# EAGLE schematic ARM_board (EAGLE 6.5.0)
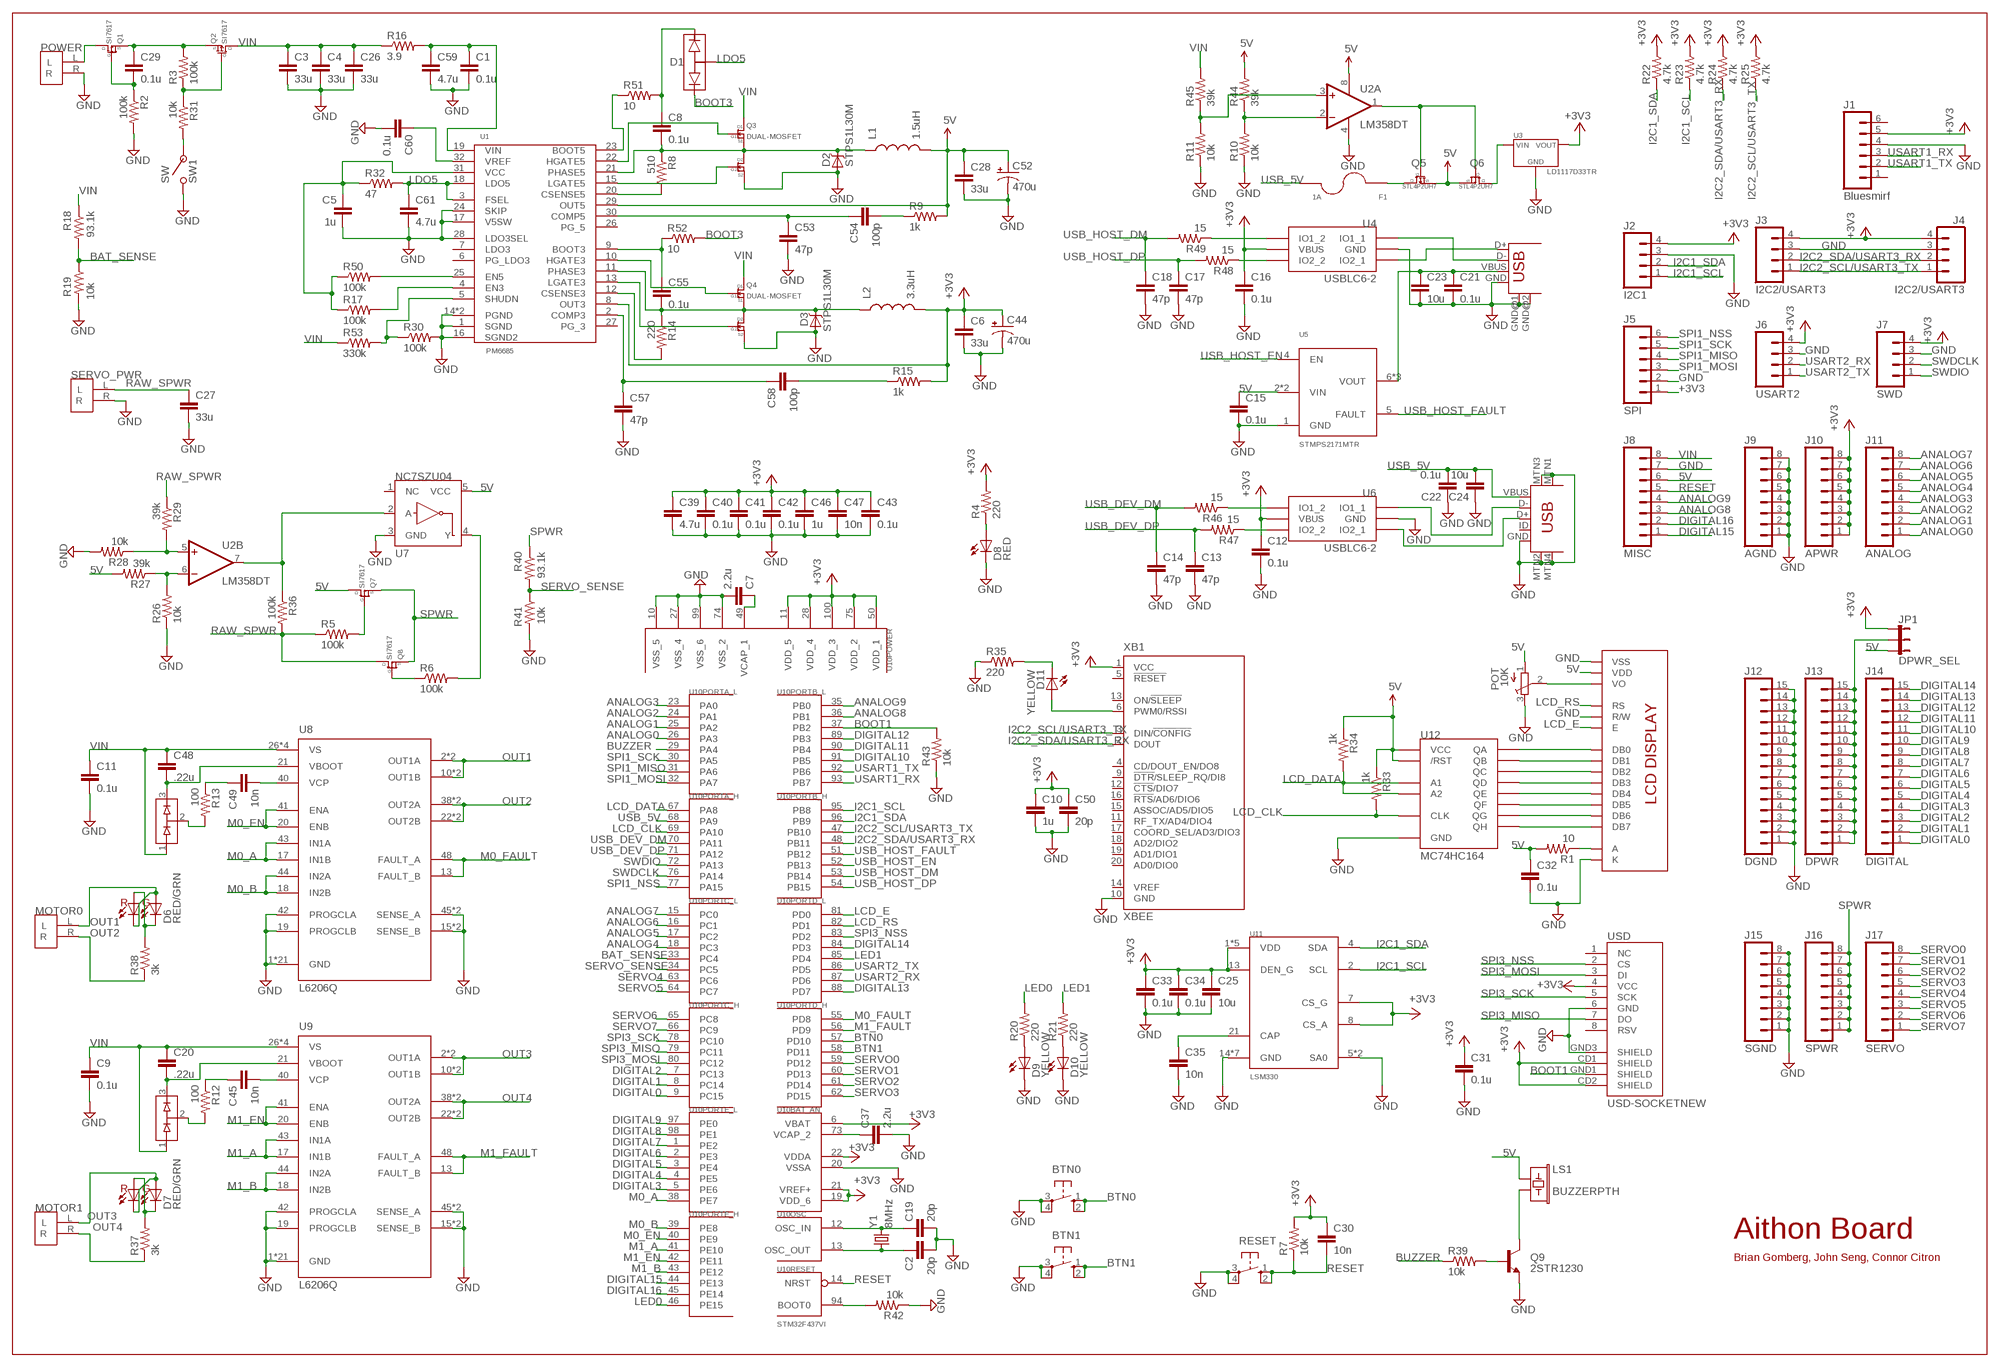
[diagram p0: schematic, sheet 1]

## Parts
BTN0  10-XX  [B3F-10XX]
BTN1  10-XX  [B3F-10XX]
C1  0.1u  CAP0402-CAP  [0402-CAP]
C2  20p  CAP0402-CAP  [0402-CAP]
C3  33u  CAP1206  [1206]
C4  33u  CAP1206  [1206]
C5  1u  CAP0402-CAP  [0402-CAP]
C6  33u  CAP0805  [0805]
C7  2.2u  CAP0402-CAP  [0402-CAP]
C8  0.1u  CAP0402-CAP  [0402-CAP]
C9  0.1u  CAP0402-CAP  [0402-CAP]
C10  1u  CAP0402-CAP  [0402-CAP]
C11  0.1u  CAP0402-CAP  [0402-CAP]
C12  0.1u  CAP0402-CAP  [0402-CAP]
C13  47p  CAP0402-CAP  [0402-CAP]
C14  47p  CAP0402-CAP  [0402-CAP]
C15  0.1u  CAP0402-CAP  [0402-CAP]
C16  0.1u  CAP0402-CAP  [0402-CAP]
C17  47p  CAP0402-CAP  [0402-CAP]
C18  47p  CAP0402-CAP  [0402-CAP]
C19  20p  CAP0402-CAP  [0402-CAP]
C20  .22u  CAP0402-CAP  [0402-CAP]
C21  0.1u  CAP0402-CAP  [0402-CAP]
C22  0.1u  CAP0402-CAP  [0402-CAP]
C23  10u  CAP0603-CAP  [0603-CAP]
C24  10u  CAP0603-CAP  [0603-CAP]
C25  10u  CAP0603-CAP  [0603-CAP]
C26  33u  CAP1206  [1206]
C27  33u  CAP1206  [1206]
C28  33u  CAP0805  [0805]
C29  0.1u  CAP0402-CAP  [0402-CAP]
C30  10n  CAP0402-CAP  [0402-CAP]
C31  0.1u  CAP0402-CAP  [0402-CAP]
C32  0.1u  CAP0402-CAP  [0402-CAP]
C33  0.1u  CAP0402-CAP  [0402-CAP]
C34  0.1u  CAP0402-CAP  [0402-CAP]
C35  10n  CAP0402-CAP  [0402-CAP]
C37  2.2u  CAP0402-CAP  [0402-CAP]
C39  4.7u  CAP0603-CAP  [0603-CAP]
C40  0.1u  CAP0402-CAP  [0402-CAP]
C41  0.1u  CAP0402-CAP  [0402-CAP]
C42  0.1u  CAP0402-CAP  [0402-CAP]
C43  0.1u  CAP0402-CAP  [0402-CAP]
C44  470u  CAP_POLD  [PANASONIC_D]
C45  10n  CAP0402-CAP  [0402-CAP]
C46  1u  CAP0402-CAP  [0402-CAP]
C47  10n  CAP0402-CAP  [0402-CAP]
C48  .22u  CAP0402-CAP  [0402-CAP]
C49  10n  CAP0402-CAP  [0402-CAP]
C50  20p  CAP0402-CAP  [0402-CAP]
C52  470u  CAP_POLD  [PANASONIC_D]
C53  47p  CAP0402-CAP  [0402-CAP]
C54  100p  CAP0402-CAP  [0402-CAP]
C55  0.1u  CAP0402-CAP  [0402-CAP]
C57  47p  CAP0402-CAP  [0402-CAP]
C58  100p  CAP0402-CAP  [0402-CAP]
C59  4.7u  CAP0603-CAP  [0603-CAP]
C60  0.1u  CAP0402-CAP  [0402-CAP]
C61  4.7u  CAP0603-CAP  [0603-CAP]
D1  BAS70-06FILM  SOD-23  [SOT-23]
D2  STPS1L30M  DIODE-SCHOTTKYA  [STPS1L30M]
D3  STPS1L30M  DIODE-SCHOTTKYA  [STPS1L30M]
D4  BAS70-05FILM  BAV99  [SOT-23]
D5  BAV99  [SOT-23]
D6  RED/GRN  LED_BICOLOR  [LED-0606]
D7  RED/GRN  LED_BICOLOR  [LED-0606]
D8  RED  LEDCHIP-LED0603  [CHIP-LED0603]
D9  YELLOW  LEDCHIP-LED0603  [CHIP-LED0603]
D10  YELLOW  LEDCHIP-LED0603  [CHIP-LED0603]
D11  YELLOW  LEDCHIP-LED0603  [CHIP-LED0603]
F1  1A  POLYFUSE  [1206]
J1  Bluesmirf  M06SIP  [1X06]
J2  I2C1  M04PTH  [1X04]
J3  I2C2/USART3  M04PTH  [1X04]
J4  I2C2/USART3  M04PTH  [1X04]
J5  SPI  M06SIP  [1X06]
J6  USART2  M04PTH  [1X04]
J7  SWD  M04PTH  [1X04]
J8  MISC  M081X08  [1X08]
J9  AGND  M081X08  [1X08]
J10  APWR  M081X08  [1X08]
J11  ANALOG  M081X08  [1X08]
J12  DGND  M15  [1X15]
J13  DPWR  M15  [1X15]
J14  DIGITAL  M15  [1X15]
J15  SGND  M081X08  [1X08]
J16  SPWR  M081X08  [1X08]
J17  SERVO  M081X08  [1X08]
JP1  DPWR_SEL  JUMPER-3PTH  [1X03]
L1  1.5uH  INDUCTOR2  [INDUCTOR-LMIP707]
L2  3.3uH  INDUCTOR3  [INDUCTOR-0520CDMCDS]
LCD  LCD_DISPLAY  [LCD]
LS1  BUZZERPTH  [BUZZER-12MM]
MOTOR0  2POS_TERMINAL  [2POS_TERMINAL]
MOTOR1  2POS_TERMINAL  [2POS_TERMINAL]
POT  10K  POT  [POT]
POWER  2POS_TERMINAL  [2POS_TERMINAL]
Q1  SI7617  [POWERPAK1212-8]
Q2  SI7617  [POWERPAK1212-8]
Q3  DUAL-MOSFET  [DUAL-MOSFET-STL60N32N3LL]
Q4  DUAL-MOSFET  [DUAL-MOSFET-STL60N32N3LL]
Q5  STL4P2UH7  [POWERFLAT]
Q6  STL4P2UH7  [POWERFLAT]
Q7  SI7617  [POWERPAK1212-8]
Q8  SI7617  [POWERPAK1212-8]
Q9  2STR1230  TRANSISTOR_NPNSOT23-3  [SOT23-3]
R1  10  RESISTOR0402-RES  [0402-RES]
R2  100k  RESISTOR0402-RES  [0402-RES]
R3  100k  RESISTOR0402-RES  [0402-RES]
R4  220  RESISTOR0402-RES  [0402-RES]
R5  100k  RESISTOR0402-RES  [0402-RES]
R6  100k  RESISTOR0402-RES  [0402-RES]
R7  10k  RESISTOR0402-RES  [0402-RES]
R8  510  RESISTOR0402-RES  [0402-RES]
R9  1k  RESISTOR0402-RES  [0402-RES]
R10  10k  RESISTOR0402-RES  [0402-RES]
R11  10k  RESISTOR0402-RES  [0402-RES]
R12  100  RESISTOR0402-RES  [0402-RES]
R13  100  RESISTOR0402-RES  [0402-RES]
R14  220  RESISTOR0402-RES  [0402-RES]
R15  1k  RESISTOR0402-RES  [0402-RES]
R16  3.9  RESISTOR0402-RES  [0402-RES]
R17  100k  RESISTOR0402-RES  [0402-RES]
R18  93.1k  RESISTOR0402-RES  [0402-RES]
R19  10k  RESISTOR0402-RES  [0402-RES]
R20  220  RESISTOR0402-RES  [0402-RES]
R21  220  RESISTOR0402-RES  [0402-RES]
R22  4.7k  RESISTOR0402-RES  [0402-RES]
R23  4.7k  RESISTOR0402-RES  [0402-RES]
R24  4.7k  RESISTOR0402-RES  [0402-RES]
R25  4.7k  RESISTOR0402-RES  [0402-RES]
R26  10k  RESISTOR0402-RES  [0402-RES]
R27  39k  RESISTOR0402-RES  [0402-RES]
R28  10k  RESISTOR0402-RES  [0402-RES]
R29  39k  RESISTOR0402-RES  [0402-RES]
R30  100k  RESISTOR0402-RES  [0402-RES]
R31  10k  RESISTOR0402-RES  [0402-RES]
R32  47  RESISTOR0402-RES  [0402-RES]
R33  1k  RESISTOR0402-RES  [0402-RES]
R34  1k  RESISTOR0402-RES  [0402-RES]
R35  220  RESISTOR0402-RES  [0402-RES]
R36  100k  RESISTOR0402-RES  [0402-RES]
R37  3k  RESISTOR0603-RES  [0603-RES]
R38  3k  RESISTOR0603-RES  [0603-RES]
R39  10k  RESISTOR0402-RES  [0402-RES]
R40  93.1k  RESISTOR0402-RES  [0402-RES]
R41  10k  RESISTOR0402-RES  [0402-RES]
R42  10k  RESISTOR0402-RES  [0402-RES]
R43  10k  RESISTOR0402-RES  [0402-RES]
R44  39k  RESISTOR0402-RES  [0402-RES]
R45  39k  RESISTOR0402-RES  [0402-RES]
R46  15  RESISTOR0402-RES  [0402-RES]
R47  15  RESISTOR0402-RES  [0402-RES]
R48  15  RESISTOR0402-RES  [0402-RES]
R49  15  RESISTOR0402-RES  [0402-RES]
R50  100k  RESISTOR0402-RES  [0402-RES]
R51  10  RESISTOR0402-RES  [0402-RES]
R52  10  RESISTOR0402-RES  [0402-RES]
R53  330k  RESISTOR0402-RES  [0402-RES]
RESET  10-XX  [B3F-10XX]
SERVO_PWR  2POS_TERMINAL  [2POS_TERMINAL]
SW1  SW  [SW]
U1  PM6685  [VFQFPN-32]
U2  LM358DT  LM358D  [SO08]
U3  LD1117D33TR  LD1117  [8-SOIC]
U4  USBLC6-2  [SOT23-6L]
U5  STMPS2171MTR  RT9715  [8-SOIC]
U6  USBLC6-2  [SOT23-6L]
U7  NC7SZU04  INVERTER""  [SC70]
U8  L6206Q  [VFQFPN48]
U9  L6206Q  [VFQFPN48]
U10  STM32F437VI  STM32F407VET  [TQFP100]
U11  LSM330  [LSM330]
U12  MC74HC164  [TSSOP-14]
USB1  USB-A-S  [USB-A-S]
USB2  USB-MINIB-5PIN  [USB-MINIB]
USD  USD-SOCKETNEW  [MICRO-SD-SOCKET-PP]
XB1  XBEE  [XBEE]
Y1  8MHz  CRYSTALSMD  [HC49UP]

## Nets
5V: C15.1 C28.1 C32.1 C52.+ J8.6 JP1.3 L1.P$2 LCD.VDD LS1.+ POT.1(A) Q5.4(S) Q5.7(S) Q6.4(S) Q6.7(S) Q7.5(D) Q7.6(D) Q7.7(D) Q7.8(D) Q7.PAD(D) R1.2 R9.2 R27.2 R33.1 R34.1 R44.2 U1.29(OUT5) U2.8(P:V+) U5.2(VIN) U5.3(VIN) U7.5(VCC) U12.9(/RST) U12.14(VCC)
+3V3: C6.1 C10.1 C12.1 C16.1 C25.1 C30.1 C31.1 C33.1 C34.1 C39.1 C40.1 C41.1 C42.1 C43.1 C44.+ C46.1 C47.1 C50.1 J1.5 J2.4 J3.4 J4.4 J5.1 J6.4 J7.4 J10.1 J10.2 J10.3 J10.4 J10.5 J10.6 J10.7 J10.8 JP1.1 L2.P$2 R4.2 R7.2 R15.2 R22.2 R23.2 R24.2 R25.2 U1.8(OUT3) U3.2(VOUT) U3.3(VOUT) U3.6(VOUT) U3.7(VOUT) U4.P$5(VBUS) U6.P$5(VBUS) U10.6(BAT_AN:VBAT) U10.11(POWER:VDD_5) U10.19(BAT_AN:VDD_6) U10.21(BAT_AN:VREF+) U10.22(BAT_AN:VDDA) U10.28(POWER:VDD_4) U10.50(POWER:VDD_1) U10.75(POWER:VDD_2) U10.100(POWER:VDD_3) U11.1(VDD) U11.3(VDD) U11.7(CS_G) U11.8(CS_A) U11.13(DEN_G) U11.22(VDD) U11.23(VDD) U11.24(VDD) USD.4(VCC) USD.CD1(SHIELD) USD.CD2(SHIELD) XB1.1(VCC)
ANALOG0: J11.1 U10.26(PORTA_L:PA3)
ANALOG1: J11.2 U10.25(PORTA_L:PA2)
ANALOG2: J11.3 U10.24(PORTA_L:PA1)
ANALOG3: J11.4 U10.23(PORTA_L:PA0)
ANALOG4: J11.5 U10.18(PORTC_L:PC3)
ANALOG5: J11.6 U10.17(PORTC_L:PC2)
ANALOG6: J11.7 U10.16(PORTC_L:PC1)
ANALOG7: J11.8 U10.15(PORTC_L:PC0)
ANALOG8: J8.3 U10.36(PORTB_L:PB1)
ANALOG9: J8.4 U10.35(PORTB_L:PB0)
BAT_SENSE: R18.2 R19.1 U10.33(PORTC_L:PC4)
BOOT1: R43.2 U10.37(PORTB_L:PB2) USD.GND1(SHIELD)
BOOT3: D1.P$2 R52.2
BTN0: BTN0.1(S) BTN0.2(S1) U10.57(PORTD_H:PD10)
BTN1: BTN1.1(S) BTN1.2(S1) U10.58(PORTD_H:PD11)
BUZZER: R39.1 U10.29(PORTA_L:PA4)
DIGITAL0: J14.1 U10.9(PORTC_H:PC15)
DIGITAL1: J14.2 U10.8(PORTC_H:PC14)
DIGITAL2: J14.3 U10.7(PORTC_H:PC13)
DIGITAL3: J14.4 U10.5(PORTE_L:PE6)
DIGITAL4: J14.5 U10.4(PORTE_L:PE5)
DIGITAL5: J14.6 U10.3(PORTE_L:PE4)
DIGITAL6: J14.7 U10.2(PORTE_L:PE3)
DIGITAL7: J14.8 U10.1(PORTE_L:PE2)
DIGITAL8: J14.9 U10.98(PORTE_L:PE1)
DIGITAL9: J14.10 U10.97(PORTE_L:PE0)
DIGITAL10: J14.11 U10.91(PORTB_L:PB5)
DIGITAL11: J14.12 U10.90(PORTB_L:PB4)
DIGITAL12: J14.13 U10.89(PORTB_L:PB3)
DIGITAL13: J14.14 U10.88(PORTD_L:PD7)
DIGITAL14: J14.15 U10.84(PORTD_L:PD3)
DIGITAL15: J8.1 U10.44(PORTE_H:PE13)
DIGITAL16: J8.2 U10.45(PORTE_H:PE14)
GND: BTN0.3(P) BTN0.4(P1) BTN1.3(P) BTN1.4(P1) C1.2 C2.2 C3.2 C4.2 C5.2 C6.2 C7.2 C9.2 C10.2 C11.2 C12.2 C13.2 C14.2 C15.2 C16.2 C17.2 C18.2 C19.2 C21.2 C22.1 C23.2 C24.1 C25.2 C26.2 C27.2 C28.2 C31.2 C32.2 C33.2 C34.2 C35.2 C37.2 C39.2 C40.2 C41.2 C42.2 C43.2 C44.- C46.2 C47.2 C50.2 C52.- C53.2 C57.2 C59.2 C60.2 C61.2 D2.P$1(A) D3.P$1(A) D8.C D9.C D10.C J1.4 J2.3 J3.3 J4.3 J5.2 J6.3 J7.3 J8.7 J9.1 J9.2 J9.3 J9.4 J9.5 J9.6 J9.7 J9.8 J12.1 J12.2 J12.3 J12.4 J12.5 J12.6 J12.7 J12.8 J12.9 J12.10 J12.11 J12.12 J12.13 J12.14 J12.15 J15.1 J15.2 J15.3 J15.4 J15.5 J15.6 J15.7 J15.8 LCD.K LCD.R/W LCD.VSS POT.3(E) POWER.R Q3.5/6/7(S2) Q4.5/6/7(S2) Q9.2(E) R2.2 R10.1 R11.1 R19.2 R26.1 R28.2 R30.2 R35.1 R41.2 R42.1 R43.1 RESET.3(P) RESET.4(P1) SERVO_PWR.R SW1.P$1 SW1.P$3 U1.1(SGND) U1.14(PGND) U1.16(SGND2) U1.17(V5SW) U1.24(SKIP) U1.28(LDO3SEL) U1.PAD(PGND) U2.4(P:V-) U3.1(GND) U4.P$2(GND) U5.1(GND) U6.P$2(GND) U7.3(GND) U8.1(GND) U8.4(GND) U8.5(GND) U8.6(GND) U8.7(GND) U8.8(GND) U8.9(GND) U8.12(GND) U8.14(GND) U8.15(SENSE_B) U8.16(SENSE_B) U8.19(PROGCLB) U8.24(GND) U8.25(GND) U8.28(GND) U8.29(GND) U8.30(GND) U8.31(GND) U8.32(GND) U8.33(GND) U8.36(GND) U8.37(GND) U8.42(PROGCLA) U8.45(SENSE_A) U8.46(SENSE_A) U8.47(GND) U8.PAD(GND) U9.1(GND) U9.4(GND) U9.5(GND) U9.6(GND) U9.7(GND) U9.8(GND) U9.9(GND) U9.12(GND) U9.14(GND) U9.15(SENSE_B) U9.16(SENSE_B) U9.19(PROGCLB) U9.24(GND) U9.25(GND) U9.28(GND) U9.29(GND) U9.30(GND) U9.31(GND) U9.32(GND) U9.33(GND) U9.36(GND) U9.37(GND) U9.42(PROGCLA) U9.45(SENSE_A) U9.46(SENSE_A) U9.47(GND) U9.PAD(GND) U10.10(POWER:VSS_5) U10.20(BAT_AN:VSSA) U10.27(POWER:VSS_4) U10.74(POWER:VSS_2) U10.99(POWER:VSS_6) U11.5(SA0) U11.6(SA0) U11.14(GND) U11.15(GND) U11.16(GND) U11.17(GND) U11.18(GND) U11.19(GND) U11.20(GND) U12.7(GND) USB1.GND USB1.GND@1(GND) USB1.GND@2(GND) USB2.GND USB2.MTN1(MTN2) USB2.MTN2(MTN3) USB2.MTN3(MTN1) USB2.MTN4 USD.6(GND) USD.GND3(SHIELD) XB1.10(GND)
I2C1_SCL: J2.1 R23.1 U10.95(PORTB_H:PB8) U11.2(SCL)
I2C1_SDA: J2.2 R22.1 U10.96(PORTB_H:PB9) U11.4(SDA)
I2C2_SCL/USART3_TX: J3.1 J4.1 R25.1 U10.47(PORTB_H:PB10) XB1.3(DIN/!CONFIG)
I2C2_SDA/USART3_RX: J3.2 J4.2 R24.1 U10.48(PORTB_H:PB11) XB1.2(DOUT)
LCD_CLK: R33.2 U10.69(PORTA_H:PA10) U12.8(CLK)
LCD_DATA: R34.2 U10.67(PORTA_H:PA8) U12.1(A1) U12.2(A2)
LCD_E: LCD.E U10.81(PORTD_L:PD0)
LCD_RS: LCD.RS U10.82(PORTD_L:PD1)
LDO5: C61.1 D1.P$0 R32.2 U1.3(FSEL) U1.18(LDO5)
LED0: R20.2 U10.46(PORTE_H:PE15)
LED1: R21.2 U10.85(PORTD_L:PD4)
M0_A: U8.17(IN1B) U8.43(IN1A) U10.38(PORTE_L:PE7)
M0_B: U8.18(IN2B) U8.44(IN2A) U10.39(PORTE_H:PE8)
M0_EN: U8.20(ENB) U8.41(ENA) U10.40(PORTE_H:PE9)
M0_FAULT: U8.13(FAULT_B) U8.48(FAULT_A) U10.55(PORTD_H:PD8)
M1_A: U9.17(IN1B) U9.43(IN1A) U10.41(PORTE_H:PE10)
M1_B: U9.18(IN2B) U9.44(IN2A) U10.43(PORTE_H:PE12)
M1_EN: U9.20(ENB) U9.41(ENA) U10.42(PORTE_H:PE11)
M1_FAULT: U9.13(FAULT_B) U9.48(FAULT_A) U10.56(PORTD_H:PD9)
N$1: POWER.L Q1.5(D) Q1.6(D) Q1.7(D) Q1.8(D) Q1.PAD(D)
N$2: C29.2 Q1.4(G) R2.1
N$3: R42.2 U10.94(RESET:BOOT0)
N$4: C37.1 U10.73(BAT_AN:VCAP_2)
N$5: R11.2 R45.1 U2.3(A:+IN)
N$6: R46.1 U6.P$6(IO1_2)
N$7: C60.1 U1.32(VREF)
N$8: U6.P$3(IO2_1) USB2.D+
N$9: D8.A R4.1
N$10: R31.2 SW1.P$2
N$11: C35.1 U11.21(CAP)
N$12: R28.1 R29.2 U2.5(B:+IN)
N$13: U4.P$3(IO2_1) USB1.D+
N$14: Q5.3(G) Q6.3(G) U2.1(A:OUT)
N$15: C5.1 R17.1 R32.1 R50.1 U1.31(VCC)
N$16: U4.P$1(IO1_1) USB1.D-
N$17: U6.P$1(IO1_1) USB2.D-
N$18: D11.C R35.2
N$19: J13.1 J13.2 J13.3 J13.4 J13.5 J13.6 J13.7 J13.8 J13.9 J13.10 J13.11 J13.12 J13.13 J13.14 J13.15 JP1.2
N$20: R51.1 U1.23(BOOT5)
N$21: C21.1 C23.1 U5.6(VOUT) U5.7(VOUT) U5.8(VOUT) USB1.VBUS
N$22: Q6.1(D) Q6.2(D) Q6.5(D) Q6.6(D) Q6.8(D) U3.4(VIN)
N$23: C29.1 Q1.1(S) Q1.2(S) Q1.3(S) Q2.1(S) Q2.2(S) Q2.3(S) R3.2
N$24: C7.1 U10.49(POWER:VCAP_1)
N$25: C8.1 D1.P$1 R51.2
N$26: R26.2 R27.1 U2.6(B:-IN)
N$27: R36.1 U2.7(B:OUT) U7.2(A)
N$28: LS1.- Q9.3(C)
N$29: D11.A XB1.6(PWM0/RSSI)
N$30: R6.2 U7.4(Y)
N$31: LCD.VO POT.2(S)
N$32: F1.1 Q5.1(D) Q5.2(D) Q5.5(D) Q5.6(D) Q5.8(D)
N$33: R47.1 U6.P$4(IO2_2)
N$34: R48.1 U4.P$4(IO2_2)
N$35: R10.2 R44.1 U2.2(A:-IN)
N$36: R49.1 U4.P$6(IO1_2)
N$37: C45.1 R12.1
N$38: C45.2 U9.40(VCP)
N$39: C20.2 D5.3 U9.21(VBOOT)
N$40: D5.2 R12.2
N$41: C49.1 R13.1
N$42: D9.A R20.1
N$43: D10.A R21.1
N$44: Q4.8(G2) U1.13(LGATE3)
N$45: C49.2 U8.40(VCP)
N$46: C19.1 U10.12(OSC:OSC_IN) Y1.2
N$47: C2.1 U10.13(OSC:OSC_OUT) Y1.1
N$48: C48.2 D4.3 U8.21(VBOOT)
N$49: D4.2 R13.2
N$50: Q7.4(G) R5.2
N$51: D7.1 D7.4 R37.2
N$52: D6.1 D6.4 R38.2
N$53: Q8.4(G) R6.1
N$54: LCD.A R1.1
N$55: R8.2 U1.20(CSENSE5)
N$56: Q3.1(G1) U1.22(HGATE5)
N$57: Q3.8(G2) U1.15(LGATE5)
N$58: LCD.DB0 U12.3(QA)
N$59: C55.1 R52.1 U1.9(BOOT3)
N$60: LCD.DB1 U12.4(QB)
N$61: LCD.DB2 U12.5(QC)
N$62: LCD.DB3 U12.6(QD)
N$63: LCD.DB4 U12.10(QE)
N$64: LCD.DB5 U12.11(QF)
N$65: Q9.1(B) R39.2
N$66: C8.2 D2.C2(C) D2.P$2(C) L1.P$1 Q3.S1D2(S1) R8.1 U1.21(PHASE5)
N$67: C54.2 R9.1
N$68: Q2.4(G) R3.1 R31.1
N$69: C53.1 C54.1 U1.30(COMP5)
N$70: LCD.DB6 U12.12(QG)
N$71: LCD.DB7 U12.13(QH)
N$73: Q4.1(G1) U1.10(HGATE3)
N$75: C55.2 D3.C2(C) D3.P$2(C) L2.P$1 Q4.S1D2(S1) R14.1 U1.11(PHASE3)
N$76: R14.2 U1.12(CSENSE3)
N$77: C57.1 C58.1 U1.2(COMP3)
N$78: C58.2 R15.1
N$79: C1.1 C59.1 R16.2 U1.19(VIN)
N$82: R30.1 R53.2 U1.5(SHUDN)
N$83: R17.2 U1.4(EN3)
N$84: R50.2 U1.25(EN5)
OUT1: D6.2 D6.3 MOTOR0.L U8.2(OUT1A) U8.3(OUT1A) U8.10(OUT1B) U8.11(OUT1B)
OUT2: MOTOR0.R R38.1 U8.22(OUT2B) U8.23(OUT2B) U8.38(OUT2A) U8.39(OUT2A)
OUT3: D7.2 D7.3 MOTOR1.L U9.2(OUT1A) U9.3(OUT1A) U9.10(OUT1B) U9.11(OUT1B)
OUT4: MOTOR1.R R37.1 U9.22(OUT2B) U9.23(OUT2B) U9.38(OUT2A) U9.39(OUT2A)
RAW_SPWR: C27.1 Q8.5(D) Q8.6(D) Q8.7(D) Q8.8(D) Q8.PAD(D) R5.1 R29.1 R36.2 SERVO_PWR.L
RESET: C30.2 J8.5 R7.1 RESET.1(S) RESET.2(S1) U10.14(RESET:NRST)
SERVO0: J17.8 U10.59(PORTD_H:PD12)
SERVO1: J17.7 U10.60(PORTD_H:PD13)
SERVO2: J17.6 U10.61(PORTD_H:PD14)
SERVO3: J17.5 U10.62(PORTD_H:PD15)
SERVO4: J17.4 U10.63(PORTC_L:PC6)
SERVO5: J17.3 U10.64(PORTC_L:PC7)
SERVO6: J17.2 U10.65(PORTC_H:PC8)
SERVO7: J17.1 U10.66(PORTC_H:PC9)
SERVO_SENSE: R40.2 R41.1 U10.34(PORTC_L:PC5)
SPI1_MISO: J5.4 U10.31(PORTA_L:PA6)
SPI1_MOSI: J5.3 U10.32(PORTA_L:PA7)
SPI1_NSS: J5.6 U10.77(PORTA_H:PA15)
SPI1_SCK: J5.5 U10.30(PORTA_L:PA5)
SPI3_MISO: U10.79(PORTC_H:PC11) USD.7(DO)
SPI3_MOSI: U10.80(PORTC_H:PC12) USD.3(DI)
SPI3_NSS: U10.83(PORTD_L:PD2) USD.2(CS)
SPI3_SCK: U10.78(PORTC_H:PC10) USD.5(SCK)
SPWR: J16.1 J16.2 J16.3 J16.4 J16.5 J16.6 J16.7 J16.8 Q7.1(S) Q7.2(S) Q7.3(S) Q8.1(S) Q8.2(S) Q8.3(S) R40.1
SWDCLK: J7.2 U10.76(PORTA_H:PA14)
SWDIO: J7.1 U10.72(PORTA_H:PA13)
USART1_RX: J1.3 U10.93(PORTB_L:PB7)
USART1_TX: J1.2 U10.92(PORTB_L:PB6)
USART2_RX: J6.2 U10.87(PORTD_L:PD6)
USART2_TX: J6.1 U10.86(PORTD_L:PD5)
USB_5V: C22.2 C24.2 F1.2 U10.68(PORTA_H:PA9) USB2.VBUS
USB_DEV_DM: C14.1 R46.2 U10.70(PORTA_H:PA11)
USB_DEV_DP: C13.1 R47.2 U10.71(PORTA_H:PA12)
USB_HOST_DM: C18.1 R49.2 U10.53(PORTB_H:PB14)
USB_HOST_DP: C17.1 R48.2 U10.54(PORTB_H:PB15)
USB_HOST_EN: U5.4(EN) U10.52(PORTB_H:PB13)
USB_HOST_FAULT: U5.5(FAULT) U10.51(PORTB_H:PB12)
VIN: C3.1 C4.1 C9.1 C11.1 C20.1 C26.1 C48.1 D4.1 D5.1 J8.8 Q2.5(D) Q2.6(D) Q2.7(D) Q2.8(D) Q2.PAD(D) Q3.2/3/4(D1) Q3.D1 Q4.2/3/4(D1) Q4.D1 R16.1 R18.1 R45.2 R53.1 U8.26(VS) U8.27(VS) U8.34(VS) U8.35(VS) U9.26(VS) U9.27(VS) U9.34(VS) U9.35(VS)
Unconnected: J1.1 J1.6 U1.6(PG_LDO3) U1.7(LDO3) U1.26(PG_5) U1.27(PG_3) U7.1(NC) USB2.ID USD.1(NC) USD.8(RSV) XB1.4(CD/DOUT_EN/DO8) XB1.5(!RESET) XB1.9(!DTR!/SLEEP_RQ/DI8) XB1.11(RF_TX/AD4/DIO4) XB1.12(!CTS!/DIO7) XB1.13(ON/!SLEEP) XB1.14(VREF) XB1.15(ASSOC/AD5/DIO5) XB1.16(!RTS!/AD6/DIO6) XB1.17(COORD_SEL/AD3/DIO3) XB1.18(AD2/DIO2) XB1.19(AD1/DIO1) XB1.20(AD0/DIO0)

## Notes on the sheet
- D1
- Aithon Board
- Brian Gomberg, John Seng, Connor Citron

## Library data of the parts
BTN0 BTN1 RESET = switch-omron:10-XX: OMRON SWITCH; MPN: B3F-1000; OC_FARNELL: 176432; OC_NEWARK: 36M3542
C1-C35 C37 C39-C43 C45-C50 C53-C55 C57-C61 = SparkFun:CAP: Capacitor Standard 0603 ceramic capacitor, and 0.1" leaded capacitor.
C44 C52 = SparkFun:CAP_POL: Capacitor Polarized These are standard SMD and PTH capacitors. Normally 10uF, 47uF, and 100uF in electrolytic and tantalum varieties. Always verify the external diameter of the through hole cap, it varies with capacity, voltage, and manufacturer. The EIA devices should be standard.
D1 = r_cubed:SOD-23
D2 D3 = SparkFun:DIODE-SCHOTTKY
D4 D5 = Parts:BAV99
D6 D7 = r_cubed:LED_BICOLOR
D8-D11 = led:LED: LED OSRAM: - CHIPLED LG R971, LG N971, LY N971, LG Q971, LY Q971, LO R971, LY R971 LH N974, LH R974 LS Q976, LO Q976, LY Q976 LO Q996 - Hyper CHIPLED LW Q18S LB Q993, LB Q99A, LB R99A - SideLED LS A670, LO A670, LY A670, LG A670, LP A670 LB A673, LV A673, LT A673, LW A673 LH A674 LY A675 LS A676, LA A676, LO A676, LY A676, LW A676 LS A679, LY A679, LG A679 - Hyper Micro SIDELED® LS Y876, LA Y876, LO Y876, LY Y876 LT Y87S - SmartLED LW L88C, LW L88S LB L89C, LB L89S, LG L890 LS L89K, LO L89K, LY L89K LS L896, LA L896, LO L896, LY L896 - TOPLED LS T670, LO T670, LY T670, LG T670, LP T670 LSG T670, LSP T670, LSY T670, LOP T670, LYG T670 LG T671, LOG T671, LSG T671 LB T673, LV T673, LT T673, LW T673 LH T674 LS T676, LA T676, LO T676, LY T676, LB T676, LH T676, LSB T676, LW T676 LB T67C, LV T67C, LT T67C, LS T67K, LO T67K, LY T67K, LW E67C LS E67B, LA E67B, LO E67B, LY E67B, LB E67C, LV E67C, LT E67C LW T67C LS T679, LY T679, LG T679 LS T770, LO T770, LY T770, LG T770, LP T770 LB T773, LV T773, LT T773, LW T773 LH T774 LS E675, LA E675, LY E675, LS T675 LS T776, LA T776, LO T776, LY T776, LB T776 LHGB T686 LT T68C, LB T68C - Hyper Mini TOPLED® LB M676 - Mini TOPLED Santana® LG M470 LS M47K, LO M47K, LY M47K Source: http://www.osram.convergy.de LUXEON: - LUMILED® LXK2-PW12-R00, LXK2-PW12-S00, LXK2-PW14-U00, LXK2-PW14-V00 LXK2-PM12-R00, LXK2-PM12-S00, LXK2-PM14-U00 LXK2-PE12-Q00, LXK2-PE12-R00, LXK2-PE12-S00, LXK2-PE14-T00, LXK2-PE14-U00 LXK2-PB12-K00, LXK2-PB12-L00, LXK2-PB12-M00, LXK2-PB14-N00, LXK2-PB14-P00, LXK2-PB14-Q00 LXK2-PR12-L00, LXK2-PR12-M00, LXK2-PR14-Q00, LXK2-PR14-R00 LXK2-PD12-Q00, LXK2-PD12-R00, LXK2-PD12-S00 LXK2-PH12-R00, LXK2-PH12-S00 LXK2-PL12-P00, LXK2-PL12-Q00, LXK2-PL12-R00 Source: www.luxeon.com KINGBRIGHT: KA-3528ASYC Source: www.kingbright.com
F1 = r_cubed:POLYFUSE
J1 J5 = SparkFun:M06: Header 6 Standard 6-pin 0.1" header. Use with straight break away headers (SKU : PRT-00116), right angle break away headers (PRT-00553), swiss pins (PRT-00743), machine pins (PRT-00117), and female headers (PRT-00115). Molex polarized connector foot print use with SKU : PRT-08094 with associated crimp pins and housings. NOTES ON THE VARIANTS LOCK and LOCK_LONGPADS... This footprint was designed to help hold the alignment of a through-hole component (i.e. 6-pin header) while soldering it into place. You may notice that each hole has been shifted either up or down by 0.005 of an inch from it's more standard position (which is a perfectly straight line). This slight alteration caused the pins (the squares in the middle) to touch the edges of the holes. Because they are alternating, it causes a "brace" to hold the component in place. 0.005 has proven to be the perfect amount of "off-center" position when using our standard breakaway headers. Although looks a little odd when you look at the bare footprint, once you have a header in there, the alteration is very hard to notice. Also, if you push a header all the way into place, it is covered up entirely on the bottom side. This idea of altering the position of holes to aid alignment will be further integrated into the Sparkfun Library for other footprints. It can help hold any component with 3 or more connection pins.
J2-J4 J6 J7 = SparkFun:M04: Header 4 Standard 4-pin 0.1" header. Use with straight break away headers (SKU : PRT-00116), right angle break away headers (PRT-00553), swiss pins (PRT-00743), machine pins (PRT-00117), and female headers (PRT-00115). Molex polarized connector foot print use with SKU : PRT-08231 with associated crimp pins and housings. 1MM SMD Version SKU: PRT-10208
J8-J11 J15-J17 = SparkFun:M08: Header 8 Standard 8-pin 0.1" header. Use with straight break away headers (SKU : PRT-00116), right angle break away headers (PRT-00553), swiss pins (PRT-00743), machine pins (PRT-00117), and female headers (PRT-00115).
J12-J14 = SparkFun:M15: Header 15 Standard 15-pin 0.1" header. Use with straight break away headers (SKU : PRT-00116), right angle break away headers (PRT-00553), swiss pins (PRT-00743), machine pins (PRT-00117), and female headers (PRT-00115).
JP1 = SparkFun:JUMPER-3
L1 L2 = r_cubed:INDUCTOR
LCD = arduinoShield:LCD_DISPLAY
LS1 = SparkFun:BUZZER: Buzzer 12mm Spark Fun Electronics SKU : Comp-Buzzer
MOTOR0 MOTOR1 POWER SERVO_PWR = r_cubed:2POS_TERMINAL
POT = r_cubed:POT
Q1 Q2 Q7 Q8 = r_cubed:SI7617
Q3 Q4 = r_cubed:DUAL-MOSFET
Q5 Q6 = r_cubed:STL4P2UH7
Q9 = SparkFun:TRANSISTOR_NPN: Transistor NPN BJT configuration in SOT23 package. MMBT2222 is the common NPN we use. Double check BCE configuration again layout.
R1-R36 R39-R53 = SparkFun:RESISTOR: Resistor Basic schematic elements and footprints for 0603, 1206, and PTH resistors.
R37 R38 = SparkFun-Resistors:RESISTOR: Resistor Basic schematic elements and footprints for 0603, 1206, and PTH resistors.
SW1 = r_cubed:SW
U1 = r_cubed:PM6685
U2 = linear:LM358: OP AMP also LM158; LM258; LM2904 Source: http://cache.national.com/ds/LM/LM158.pdf
U3 = r_cubed:LD1117
U4 U6 = new_parts:USBLC6-2: ST USBLC6-2
U5 = r_cubed:RT9715
U7 = SparkFun:INVERTER: Single inverter, SOT23-5
U8 U9 = r_cubed:L6206Q
U10 = new_parts:STM32F407VET: STM32F405/407 100 pin LQFP
U11 = r_cubed:LSM330
U12 = r_cubed:MC74HC164
USB1 = con-usb-2:USB: USB Connectors
USB2 = SparkFun:USB-MINIB: Mini-USB "B" connector with 5th pin broken out. Created new symbol breaking out 5th "ID" pin in mini/micro USB connector spec. See: http://en.wikipedia.org/wiki/Mini_usb#Cables. Uses same footprint as 4-pin symbol. Also added pins to connect to mounting / shield pads if required (probably not generally needed as signals aren't shielded once they leave the connector).
USD = SparkFun:USD-SOCKET: microSD Socket Push-push type uSD socket. Schematic element and footprint production proven. Spark Fun Electronics SKU : PRT-00127. tDoc lines correctly indicate media card edge positions when inserting (unlocked, locked, depressed).
XB1 = maxstream:XBEE: XBee (TM) /XBee-PRO(TM) OEM RF Modules Source: MaxStream, Inc. xbee_productmanual.pdf; MPN: XBP24-Z7UIT-004; OC_FARNELL: 1751799; OC_NEWARK: 34R5507
Y1 = SparkFun:CRYSTAL: Crystals Various standard crystals. Proven footprints. Spark Fun Electronics SKU : COM-00534